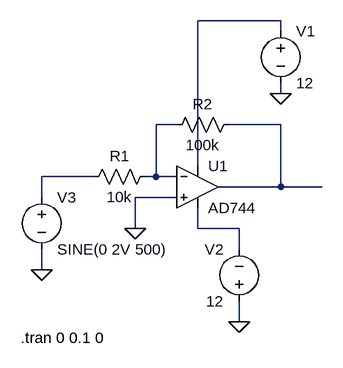
[diagram p0: schematic OpAmplifier.asc]
OpAmplifier.asc, the LTspice schematic file:
Version 4
SHEET 1 880 680
WIRE 320 -96 192 -96
WIRE 320 -80 320 -96
WIRE 320 16 320 0
WIRE 160 64 128 64
WIRE 320 64 240 64
WIRE 192 128 192 -96
WIRE 32 144 -48 144
WIRE 128 144 128 64
WIRE 128 144 112 144
WIRE 160 144 128 144
WIRE 320 160 320 64
WIRE 320 160 224 160
WIRE 384 160 320 160
WIRE -48 176 -48 144
WIRE 160 176 96 176
WIRE 96 224 96 176
WIRE 192 224 192 192
WIRE 256 224 192 224
WIRE 256 256 256 224
WIRE -48 288 -48 256
WIRE 256 368 256 336
FLAG 96 224 0
FLAG -48 288 0
FLAG 256 368 0
FLAG 320 16 0
SYMBOL OpAmps\\AD744 192 96 R0
SYMATTR InstName U1
SYMBOL voltage 320 -96 R0
WINDOW 123 0 0 Left 0
WINDOW 39 0 0 Left 0
SYMATTR InstName V1
SYMATTR Value 12
SYMBOL voltage 256 352 R180
WINDOW 0 24 96 Left 2
WINDOW 3 24 16 Left 2
WINDOW 123 0 0 Left 0
WINDOW 39 0 0 Left 0
SYMATTR InstName V2
SYMATTR Value 12
SYMBOL voltage -48 160 R0
WINDOW 123 0 0 Left 0
WINDOW 39 0 0 Left 0
SYMATTR InstName V3
SYMATTR Value SINE(0 2V 500)
SYMBOL res 128 128 R90
WINDOW 0 0 56 VBottom 2
WINDOW 3 32 56 VTop 2
SYMATTR InstName R1
SYMATTR Value 10k
SYMBOL res 256 48 R90
WINDOW 0 0 56 VBottom 2
WINDOW 3 32 56 VTop 2
SYMATTR InstName R2
SYMATTR Value 100k
TEXT -80 392 Left 2 !.tran 0 0.1 0

The netlist it stands for:
* OpAmplifier.asc
XU1 0 N002 N001 N005 N003 AD744  ; pins In+ In- V+ V- OUT
V1 N001 0 12
V2 0 N005 12
V3 N004 0 SINE(0 2V 500)
R1 N002 N004 10k
R2 N003 N002 100k
.tran 0 0.1 0
.backanno
.end